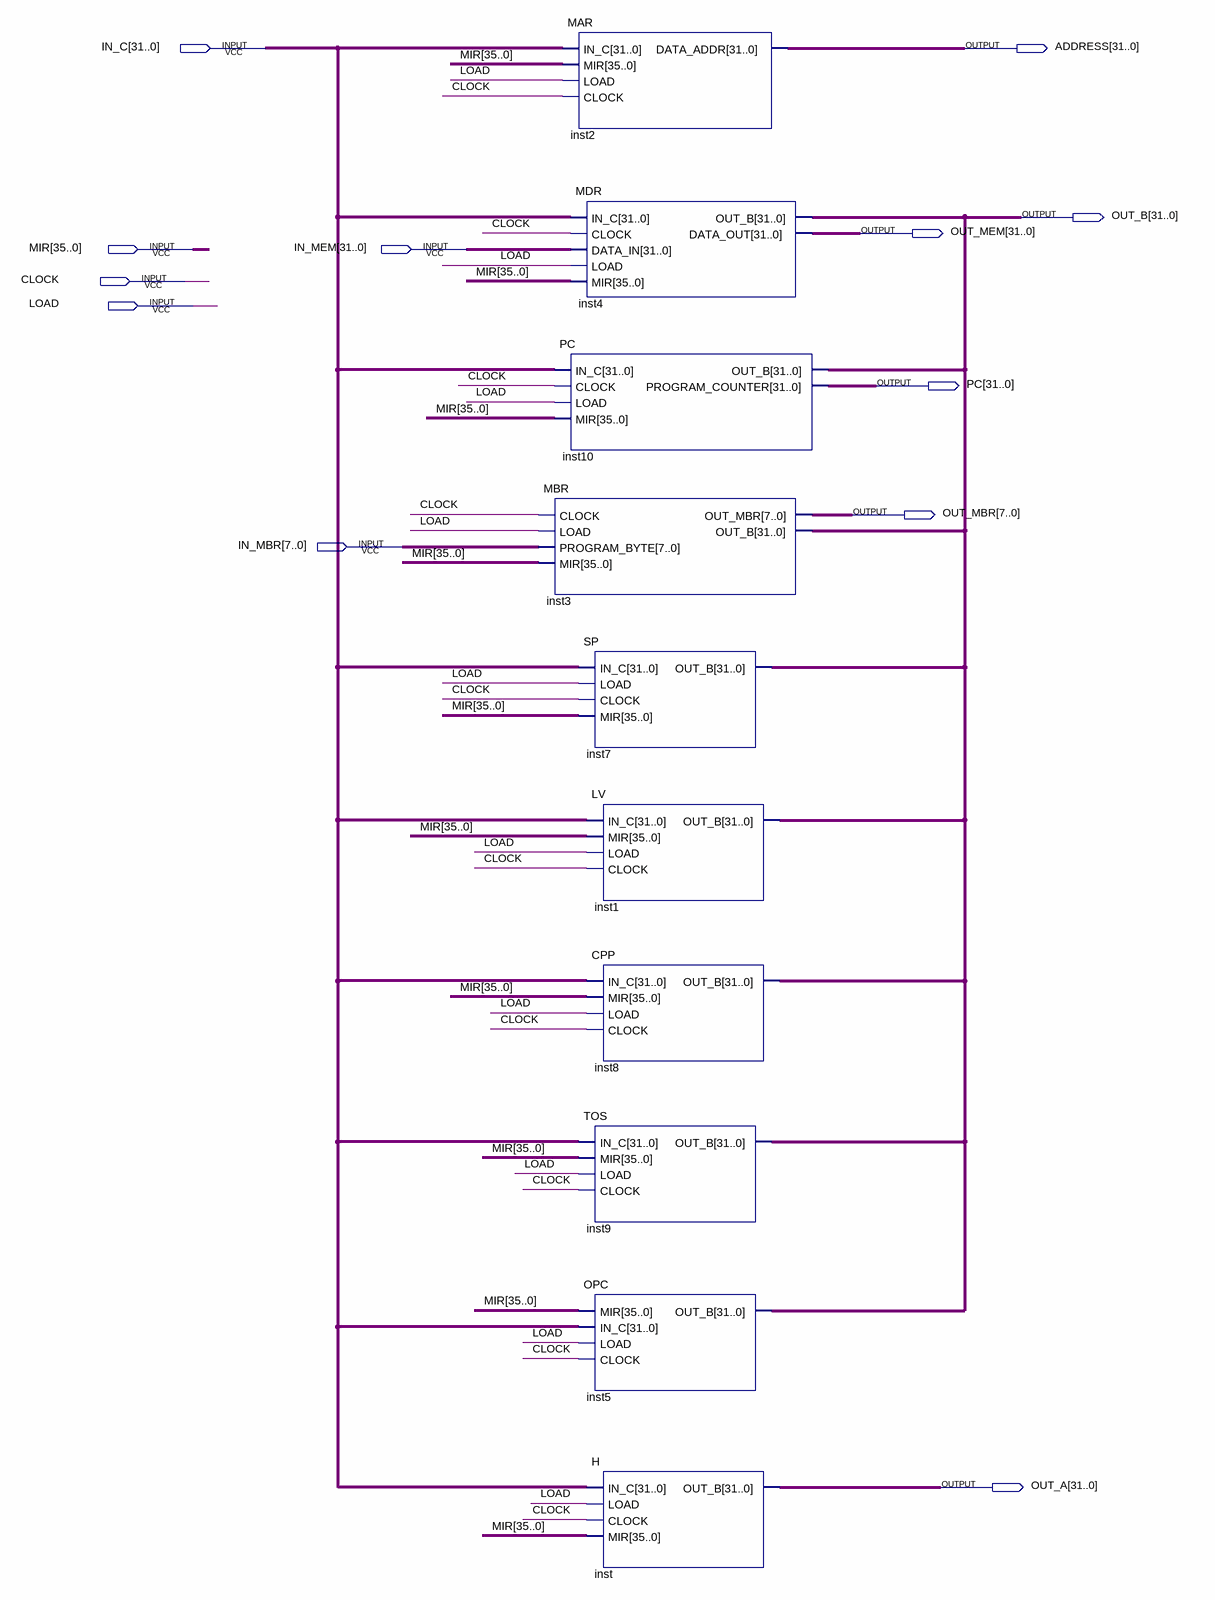
[diagram p0: schematic sheet]
// Quartus schematic BANK_REGS.bdf as structural Verilog: 10 symbols, 12 pins
module BANK_REGS (
  input  [31:0] IN_C,
  input  [35:0] MIR,
  input  [31:0] IN_MEM,
  input  CLOCK,
  input  LOAD,
  input  [7:0] IN_MBR,
  output [31:0] ADDRESS,
  output [31:0] OUT_B,
  output [31:0] OUT_MEM,
  output [31:0] PC,
  output [7:0] OUT_MBR,
  output [31:0] OUT_A
);

  MAR inst2 (.IN_C(IN_C), .MIR(MIR), .LOAD(LOAD), .CLOCK(CLOCK), .DATA_ADDR(ADDRESS));
  MDR inst4 (.IN_C(IN_C), .CLOCK(CLOCK), .DATA_IN(IN_MEM), .LOAD(LOAD), .MIR(MIR), .OUT_B(OUT_B), .DATA_OUT(OUT_MEM));
  PC inst10 (.IN_C(IN_C), .CLOCK(CLOCK), .LOAD(LOAD), .MIR(MIR), .OUT_B(OUT_B), .PROGRAM_COUNTER(PC));
  MBR inst3 (.CLOCK(CLOCK), .LOAD(LOAD), .PROGRAM_BYTE(IN_MBR), .MIR(MIR), .OUT_MBR(OUT_MBR), .OUT_B(OUT_B));
  SP inst7 (.IN_C(IN_C), .LOAD(LOAD), .CLOCK(CLOCK), .MIR(MIR), .OUT_B(OUT_B));
  LV inst1 (.IN_C(IN_C), .MIR(MIR), .LOAD(LOAD), .CLOCK(CLOCK), .OUT_B(OUT_B));
  CPP inst8 (.IN_C(IN_C), .MIR(MIR), .LOAD(LOAD), .CLOCK(CLOCK), .OUT_B(OUT_B));
  TOS inst9 (.IN_C(IN_C), .MIR(MIR), .LOAD(LOAD), .CLOCK(CLOCK), .OUT_B(OUT_B));
  OPC inst5 (.MIR(MIR), .IN_C(IN_C), .LOAD(LOAD), .CLOCK(CLOCK), .OUT_B(OUT_B));
  H inst (.IN_C(IN_C), .LOAD(LOAD), .CLOCK(CLOCK), .MIR(MIR), .OUT_B(OUT_A));
endmodule
